# Altium schematic sheet E_Tactile_Display.SchDoc
size A4; SheetNumber: 1; SheetTotal: 1
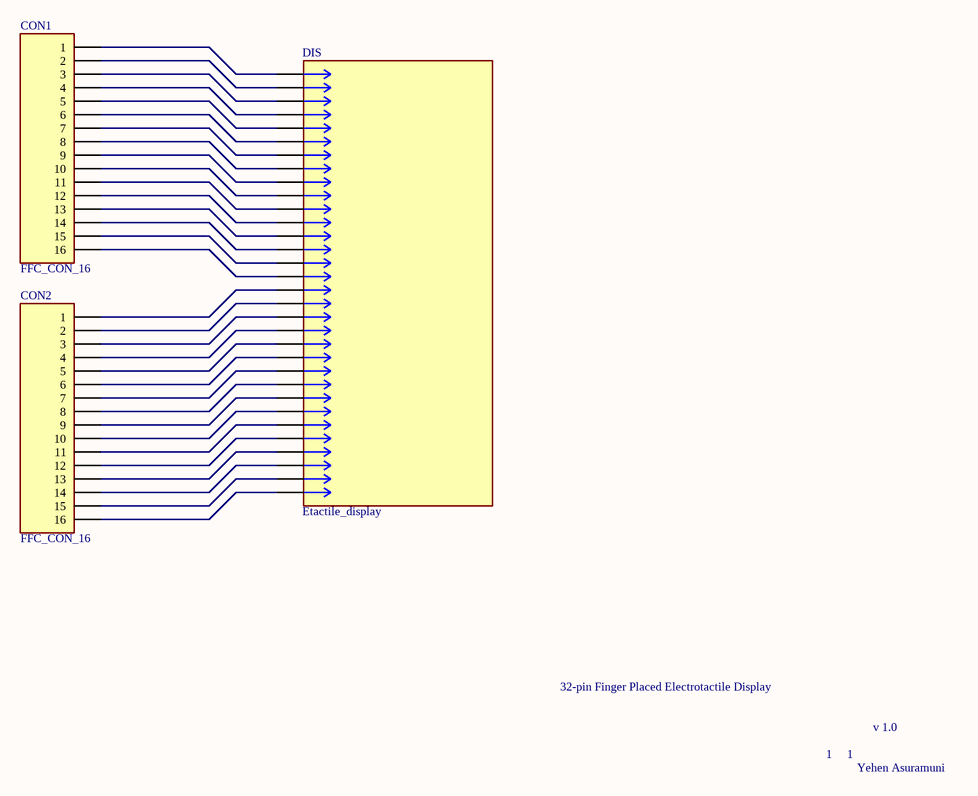
[diagram p0: E_Tactile_Display.SchDoc]

## Parts
CON1  FFC_CON_16  [16_pin_smd_connector_pads]
CON2  FFC_CON_16  [16_pin_smd_connector_pads]
DIS  Etactile_display  [Electrode_Display]

## Nets
NetCON1_1: CON1.1 DIS.0
NetCON1_2: CON1.2 DIS.1
NetCON1_3: CON1.3 DIS.2
NetCON1_4: CON1.4 DIS.3
NetCON1_5: CON1.5 DIS.4
NetCON1_6: CON1.6 DIS.5
NetCON1_7: CON1.7 DIS.6
NetCON1_8: CON1.8 DIS.7
NetCON1_9: CON1.9 DIS.8
NetCON1_10: CON1.10 DIS.9
NetCON1_11: CON1.11 DIS.10
NetCON1_12: CON1.12 DIS.11
NetCON1_13: CON1.13 DIS.12
NetCON1_14: CON1.14 DIS.13
NetCON1_15: CON1.15 DIS.14
NetCON1_16: CON1.16 DIS.15
NetCON2_1: CON2.1 DIS.16
NetCON2_2: CON2.2 DIS.17
NetCON2_3: CON2.3 DIS.18
NetCON2_4: CON2.4 DIS.19
NetCON2_5: CON2.5 DIS.20
NetCON2_6: CON2.6 DIS.21
NetCON2_7: CON2.7 DIS.22
NetCON2_8: CON2.8 DIS.23
NetCON2_9: CON2.9 DIS.24
NetCON2_10: CON2.10 DIS.25
NetCON2_11: CON2.11 DIS.26
NetCON2_12: CON2.12 DIS.27
NetCON2_13: CON2.13 DIS.28
NetCON2_14: CON2.14 DIS.29
NetCON2_15: CON2.15 DIS.30
NetCON2_16: CON2.16 DIS.31

## Notes on the sheet
- 32-pin Finger Placed Electrotactile Display
- 1     1
- v 1.0
- Yehen Asuramuni